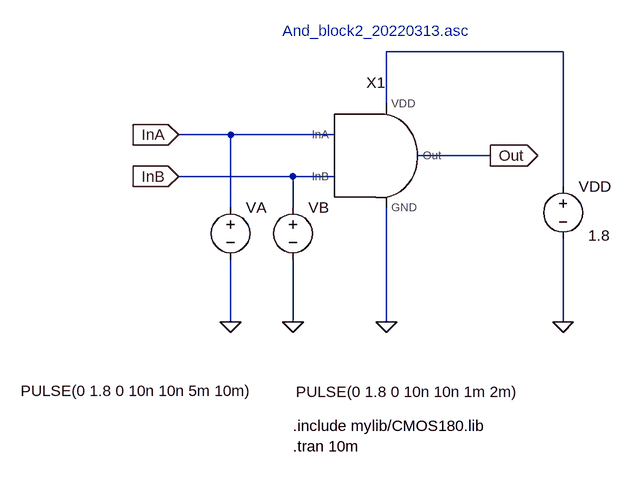
[diagram p0: schematic And_block2_20220313.asc]
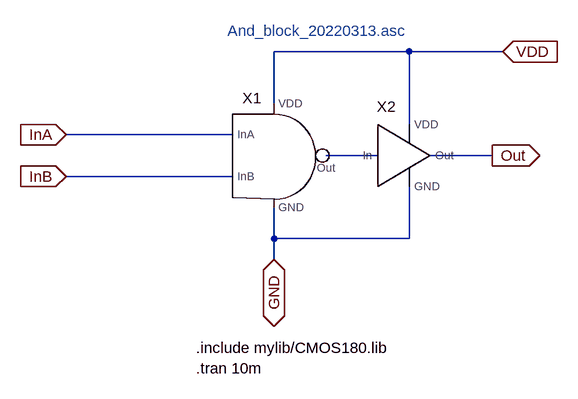
[diagram p1: sub-circuit and_block_20220313.asc]
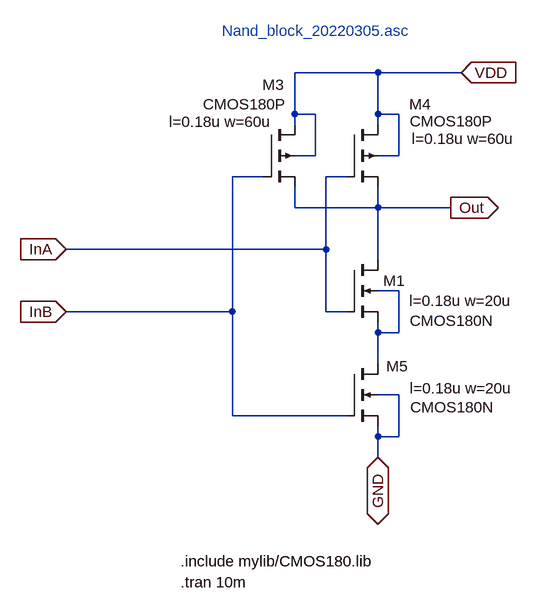
[diagram p2: sub-circuit nand_block_20220305.asc]
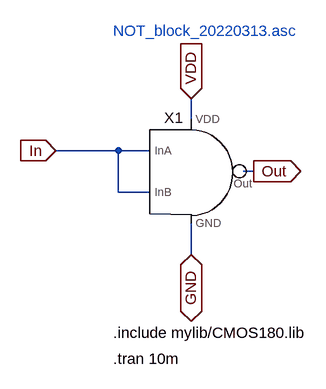
[diagram p3: sub-circuit not_block_20220313.asc]
And_block2_20220313.asc, the LTspice schematic file:
Version 4
SHEET 1 1036 680
WIRE 336 -96 64 -96
WIRE 64 -16 64 -96
WIRE -176 32 -256 32
WIRE -16 32 -176 32
WIRE 224 64 112 64
WIRE -80 96 -256 96
WIRE -16 96 -80 96
WIRE 336 112 336 -96
WIRE -176 144 -176 32
WIRE -80 144 -80 96
WIRE -176 320 -176 224
WIRE -80 320 -80 224
WIRE 64 320 64 144
WIRE 336 320 336 192
FLAG 224 64 Out
IOPIN 224 64 Out
FLAG -256 32 InA
IOPIN -256 32 In
FLAG -256 96 InB
IOPIN -256 96 In
FLAG 336 320 0
FLAG -176 320 0
FLAG -80 320 0
FLAG 64 320 0
SYMBOL voltage 336 96 R0
WINDOW 3 39 91 Left 2
WINDOW 123 0 0 Left 0
WINDOW 39 0 0 Left 0
SYMATTR Value 1.8
SYMATTR InstName VDD
SYMBOL voltage -176 128 R0
WINDOW 3 -323 298 Left 2
WINDOW 123 0 0 Left 0
WINDOW 39 0 0 Left 0
SYMATTR Value PULSE(0 1.8 0 10n 10n 5m 10m)
SYMATTR InstName VA
SYMBOL voltage -80 128 R0
WINDOW 3 5 300 Left 2
WINDOW 123 0 0 Left 0
WINDOW 39 0 0 Left 0
SYMATTR Value PULSE(0 1.8 0 10n 10n 1m 2m)
SYMATTR InstName VB
SYMBOL And_block_20220313 48 64 R0
SYMATTR InstName X1
TEXT -80 480 Left 2 !.include mylib/CMOS180.lib
TEXT -96 -128 Left 2 ;And_block2_20220313.asc
TEXT -80 512 Left 2 !.tran 10m

and_block_20220313.asc, the sub-circuit schematic file:
Version 4
SHEET 1 1036 680
WIRE 272 -96 64 -96
WIRE 416 -96 272 -96
WIRE 64 -16 64 -96
WIRE 272 16 272 -96
WIRE 0 32 -256 32
WIRE 224 64 144 64
WIRE 400 64 304 64
WIRE 0 96 -256 96
WIRE 64 192 64 144
WIRE 272 192 272 112
WIRE 272 192 64 192
WIRE 64 224 64 192
FLAG 400 64 Out
IOPIN 400 64 Out
FLAG -256 32 InA
IOPIN -256 32 In
FLAG -256 96 InB
IOPIN -256 96 In
FLAG 64 224 GND
IOPIN 64 224 BiDir
FLAG 416 -96 VDD
IOPIN 416 -96 In
SYMBOL Nand_block_20220305 64 80 R0
WINDOW 0 -34 -89 Bottom 2
SYMATTR InstName X1
SYMBOL NOT_block_20220313 288 64 R0
WINDOW 0 -51 -60 Bottom 2
SYMATTR InstName X2
TEXT -56 360 Left 2 !.include mylib/CMOS180.lib
TEXT -8 -128 Left 2 ;And_block_20220313.asc
TEXT -56 392 Left 2 !.tran 10m

nand_block_20220305.asc, the sub-circuit schematic file:
Version 4
SHEET 1 1036 680
WIRE 224 -272 96 -272
WIRE 352 -272 224 -272
WIRE 96 -208 96 -272
WIRE 128 -208 96 -208
WIRE 224 -208 224 -272
WIRE 256 -208 224 -208
WIRE 96 -192 96 -208
WIRE 224 -192 224 -208
WIRE 128 -144 128 -208
WIRE 128 -144 96 -144
WIRE 256 -144 256 -208
WIRE 256 -144 224 -144
WIRE 48 -112 0 -112
WIRE 176 -112 144 -112
WIRE 96 -64 96 -96
WIRE 224 -64 224 -96
WIRE 224 -64 96 -64
WIRE 336 -64 224 -64
WIRE 144 0 144 -112
WIRE 144 0 -256 0
WIRE 224 16 224 -64
WIRE 256 64 224 64
WIRE 0 96 0 -112
WIRE 0 96 -256 96
WIRE 144 96 144 0
WIRE 176 96 144 96
WIRE 224 128 224 112
WIRE 256 128 256 64
WIRE 256 128 224 128
WIRE 224 176 224 128
WIRE 256 224 224 224
WIRE 0 256 0 96
WIRE 176 256 0 256
WIRE 224 288 224 272
WIRE 256 288 256 224
WIRE 256 288 224 288
WIRE 224 320 224 288
FLAG 336 -64 Out
IOPIN 336 -64 Out
FLAG -256 0 InA
IOPIN -256 0 In
FLAG -256 96 InB
IOPIN -256 96 In
FLAG 224 320 GND
IOPIN 224 320 BiDir
FLAG 352 -272 VDD
IOPIN 352 -272 In
SYMBOL nmos4 176 16 R0
WINDOW 123 96 63 Left 2
WINDOW 3 97 94 Left 2
SYMATTR Value2 l=0.18u w=20u
SYMATTR Value CMOS180N
SYMATTR InstName M1
SYMBOL pmos4 48 -192 R0
WINDOW 0 -2 -61 Left 2
WINDOW 3 -93 -31 Left 2
WINDOW 123 -146 -4 Left 2
SYMATTR InstName M3
SYMATTR Value CMOS180P
SYMATTR Value2 l=0.18u w=60u
SYMBOL pmos4 176 -192 R0
WINDOW 0 96 -31 Left 2
WINDOW 3 97 -5 Left 2
WINDOW 123 100 22 Left 2
SYMATTR InstName M4
SYMATTR Value CMOS180P
SYMATTR Value2 l=0.18u w=60u
SYMBOL nmos4 176 176 R0
WINDOW 123 97 38 Left 2
WINDOW 0 61 4 Left 2
WINDOW 3 98 67 Left 2
SYMATTR Value2 l=0.18u w=20u
SYMATTR InstName M5
SYMATTR Value CMOS180N
TEXT -80 480 Left 2 !.include mylib/CMOS180.lib
TEXT -16 -336 Left 2 ;Nand_block_20220305.asc
TEXT -80 512 Left 2 !.tran 10m

not_block_20220313.asc, the sub-circuit schematic file:
Version 4
SHEET 1 1036 680
WIRE 112 -48 112 -80
WIRE 0 0 -96 0
WIRE 48 0 0 0
WIRE 208 32 192 32
WIRE 0 64 0 0
WIRE 48 64 0 64
WIRE 112 160 112 112
FLAG 208 32 Out
IOPIN 208 32 Out
FLAG -96 0 In
IOPIN -96 0 In
FLAG 112 160 GND
IOPIN 112 160 BiDir
FLAG 112 -80 VDD
IOPIN 112 -80 In
SYMBOL Nand_block_20220305 112 48 R0
WINDOW 0 -27 -83 Bottom 2
SYMATTR InstName X1
TEXT -8 280 Left 2 !.include mylib/CMOS180.lib
TEXT -8 -184 Left 2 ;NOT_block_20220313.asc
TEXT -8 320 Left 2 !.tran 10m

The netlist it stands for:
* And_block2_20220313.asc
VDD N001 0 1.8
VA InA 0 PULSE(0 1.8 0 10n 10n 5m 10m)
VB InB 0 PULSE(0 1.8 0 10n 10n 1m 2m)
XX1 InA InB N001 0 Out and_block_20220313

* block symbol definitions
.subckt and_block_20220313 InA InB VDD GND Out
XX1 InA InB VDD GND N001 nand_block_20220305
XX2 N001 VDD GND Out not_block_20220313
.include mylib/CMOS180.lib
* And_block_20220313.asc
.tran 10m
.ends and_block_20220313

.subckt nand_block_20220305 InA InB VDD GND Out
M1 Out InA N001 N001 CMOS180N l=0.18u w=20u
M3 VDD InB Out VDD CMOS180P l=0.18u w=60u
M4 VDD InA Out VDD CMOS180P l=0.18u w=60u
M5 N001 InB GND GND CMOS180N l=0.18u w=20u
.include mylib/CMOS180.lib
* Nand_block_20220305.asc
.tran 10m
.ends nand_block_20220305

.subckt not_block_20220313 In VDD GND Out
XX1 In In VDD GND Out nand_block_20220305
.include mylib/CMOS180.lib
* NOT_block_20220313.asc
.tran 10m
.ends not_block_20220313

.model NMOS NMOS
.model PMOS PMOS
.lib standard.mos
.include mylib/CMOS180.lib
* And_block2_20220313.asc
.tran 10m
.backanno
.end